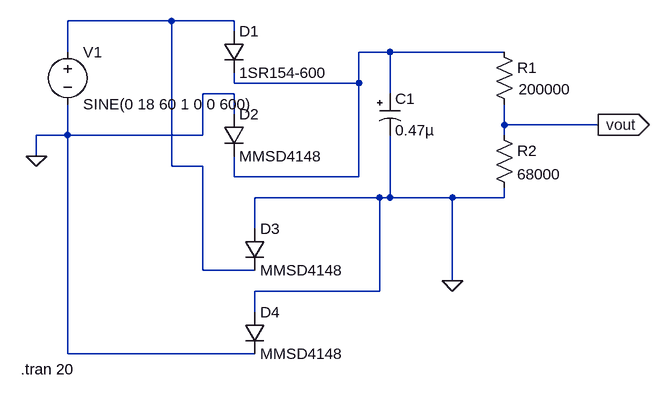
[diagram p0: schematic fullbridge-18v.asc]
fullbridge-18v.asc, the LTspice schematic file:
Version 4
SHEET 1 880 680
WIRE 96 -32 -64 -32
WIRE 192 -32 96 -32
WIRE 192 -16 192 -32
WIRE -64 16 -64 -32
WIRE 432 16 384 16
WIRE 608 16 432 16
WIRE 192 64 192 48
WIRE 384 64 384 16
WIRE 384 64 192 64
WIRE 192 80 144 80
WIRE 432 80 432 16
WIRE 192 112 192 80
WIRE 608 128 608 96
WIRE 752 128 608 128
WIRE -64 144 -64 96
WIRE -64 144 -112 144
WIRE 144 144 144 80
WIRE 144 144 -64 144
WIRE 608 144 608 128
WIRE -112 176 -112 144
WIRE 96 192 96 -32
WIRE 144 192 96 192
WIRE 192 208 192 176
WIRE 384 208 384 64
WIRE 384 208 192 208
WIRE 416 240 224 240
WIRE 432 240 432 144
WIRE 432 240 416 240
WIRE 528 240 432 240
WIRE 608 240 608 224
WIRE 608 240 528 240
WIRE 224 288 224 240
WIRE 144 352 144 192
WIRE 224 352 144 352
WIRE 528 368 528 240
WIRE 416 384 416 240
WIRE 416 384 224 384
WIRE 224 416 224 384
WIRE -64 480 -64 144
WIRE 224 480 -64 480
FLAG -112 176 0
FLAG 528 368 0
FLAG 752 128 vout
IOPIN 752 128 Out
SYMBOL voltage -64 0 R0
WINDOW 123 0 0 Left 2
WINDOW 39 0 0 Left 2
SYMATTR InstName V1
SYMATTR Value SINE(0 18 60 1 0 0 600)
SYMBOL diode 176 -16 R0
SYMATTR InstName D1
SYMATTR Value 1SR154-600
SYMBOL diode 176 112 R0
SYMATTR InstName D2
SYMATTR Value MMSD4148
SYMBOL res 592 0 R0
WINDOW 3 38 73 Left 2
SYMATTR Value 200000
SYMATTR InstName R1
SYMATTR SpiceLine pwr=0.25
SYMBOL diode 208 288 R0
SYMATTR InstName D3
SYMATTR Value MMSD4148
SYMBOL diode 208 416 R0
SYMATTR InstName D4
SYMATTR Value MMSD4148
SYMBOL polcap 416 80 R0
WINDOW 3 24 56 Left 2
SYMATTR Value 0.47µ
SYMATTR InstName C1
SYMATTR Description Capacitor
SYMATTR Type cap
SYMATTR SpiceLine V=50 Irms=250m Rser=0.6 Lser=0
SYMBOL res 592 128 R0
SYMATTR InstName R2
SYMATTR Value 68000
SYMATTR SpiceLine pwr=0.25
TEXT -136 504 Left 2 !.tran 20

The netlist it stands for:
* fullbridge-18v.asc
V1 N001 0 SINE(0 18 60 1 0 0 600)
D1 N001 N002 1SR154-600
D2 0 N002 MMSD4148
R1 N002 vout 200000 pwr=0.25
D3 0 N001 MMSD4148
D4 0 0 MMSD4148
C1 N002 0 0.47µ V=50 Irms=250m Rser=0.6 Lser=0
R2 vout 0 68000 pwr=0.25
.model D D
.lib standard.dio
.tran 20
.backanno
.end